# Altium project Street_light_driver_30W.PrjPcb
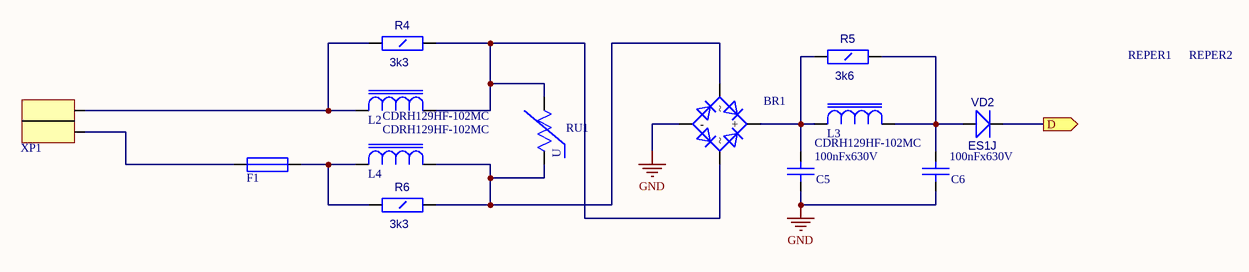
[diagram p0: Main.SchDoc]
2 sheets, 27 parts. Net scope: flat (ports and power ports of the same name join across sheets).
Board file: Street_light_driver_30W.PcbDoc
Sheets:
  Main.SchDoc
  ICS.SchDoc

## Sheet Main.SchDoc
size A4

### Parts
BR1  DF10S  [SDIP]  (value not drawn)
C5  100nFx630V  [CAP_630V_SMD]
C6  100nFx630V  [CAP_630V_SMD]
F1  *  [Fuse Belfuse]  (value not drawn)
L2  CDRH129HF-102MC  [IND_CDRH129]
L3  CDRH129HF-102MC  [IND_CDRH129]
L4  CDRH129HF-102MC  [IND_CDRH129]
R4  3k3  [RC1206]
R5  3k6  [RC1206]
R6  3k3  [RC1206]
REPER1  REPER1.2  [REPER1.2]  (value not drawn)
REPER2  REPER1.2  [REPER1.2]  (value not drawn)
RU1  KLS6-07D  [Varistor_7mm_SMD]  (value not drawn)
VD2  ES1J  [SMA]
XP1  *  [Poke-In 2pin]  (value not drawn)

### Ports
D (out)

### Nets
GND: BR1.2(-) C5.1(A) C6.1(A)
NetBR1_1: BR1.1(+) C5.2(B) L3.1(A) R5.1(A)
NetBR1_3: BR1.3 L4.2(B) R6.2(B) RU1.1(A)
NetBR1_4: BR1.4 L2.2(B) R4.2(B) RU1.2(B)
NetC6_2: C6.2(B) L3.2(B) R5.2(B) VD2.1(A)
NetDA1_6: VD2.2(K) ; port D
NetF1_1: F1.1 XP1.4
NetF1_2: F1.2 L4.1(A) R6.1(A)
NetL2_1: L2.1(A) R4.1(A) XP1.3

Not connected (* = marked no-connect by the designer): REPER1 1; REPER2 1

### Notes on the sheet
- (in symbol KLS6-07D) U

### Library data of the parts
C5 C6 = Cap_HV: Value: 100nFx630V
F1 = Fuse Belufse: Value: *
L2-L4 = CDRH129: Value: CDRH129HF-102MC
R4-R6 = RC1206
  R4 R6: Value: 3k3
  R5: Value: 3k6
VD2 = SS14: Schottky Rectifier; OriginalName: 10BQ100; ComponentField6: Published 8-Jun-2000, Modified 10-July-2000: SIM Model Added.; Value: ES1J
XP1 = Poke-IN 2Pin: Value: *
BR1 = DF10S: Value: DF10S
REPER1 REPER2 = REPER1.2: Value: *
RU1 = KLS6-07D: Value: KLS6-07D

## Sheet ICS.SchDoc
size A4
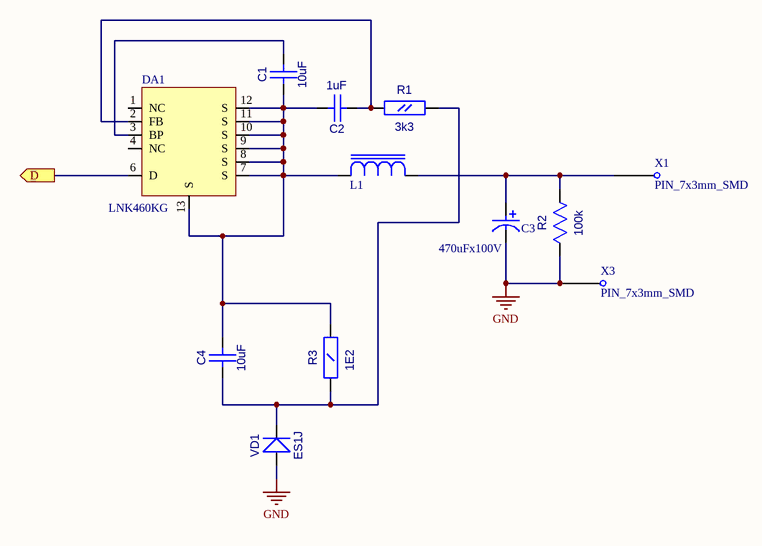
[diagram p1: ICS.SchDoc]

### Parts
C1  10uF  [CC1206]
C2  1uF  [CC0805]
C3  470uFx100V  [CAP_7.5_SMD_2]
C4  10uF  [CC1206]
DA1  LNK460KG  [eSOP-12]
L1  CDRH129HF-331MC  [IND_CDRH129]  (value not drawn)
R1  3k3  [RC0805]
R2  100k  [RC0805]
R3  1E2  [RC1206]
VD1  ES1J  [SMA]
X1  PIN_7x3mm_SMD  [PIN_7x3mm_SMD]
X3  PIN_7x3mm_SMD  [PIN_7x3mm_SMD]

### Ports
D (out)

### Nets
GND: C3.1 R2.1(A) VD1.1(A) X3.1
NetC1_1: C1.1(A) C2.2(B) C4.2(B) DA1.7(S) DA1.8(S) DA1.9(S) DA1.10(S) DA1.11(S) DA1.12(S) DA1.13(S) L1.1(A) R3.2(B)
NetC1_2: C1.2(B) DA1.3(BP)
NetC2_1: C2.1(A) DA1.2(FB) R1.1(A)
NetC3_2: C3.2 L1.2(B) R2.2(B) X1.1
NetC4_1: C4.1(A) R1.2(B) R3.1(A) VD1.2(K)
NetDA1_6: DA1.6(D) ; port D

Not connected (* = marked no-connect by the designer): DA1 1(NC) 4(NC)

### Library data of the parts
C1 C4 = CC1206: Value: 10uF
C2 = CC0805: Value: 1uF
C3 = CAP_16x25: Value: 470uFx100V
L1 = CDRH129: Value: CDRH129HF-331MC
R1 R2 = RC0805
  R1: Value: 3k3
  R2: Value: 100k
R3 = RC1206: Value: 1E2
VD1 = SS14: Schottky Rectifier; Value: ES1J
DA1 = LNK460KG: Value: LNK460KG

## Nets that join several sheets
GND: Main (BR1.2 C5.1 C6.1), ICS (C3.1 R2.1 VD1.1 X3.1)
NetDA1_6: Main (VD2.2), ICS (DA1.6)